# Altium schematic sheet L3X-433UD33X_Footprint&Part_PCB_AD.SchDoc
size 863 x 558 mm
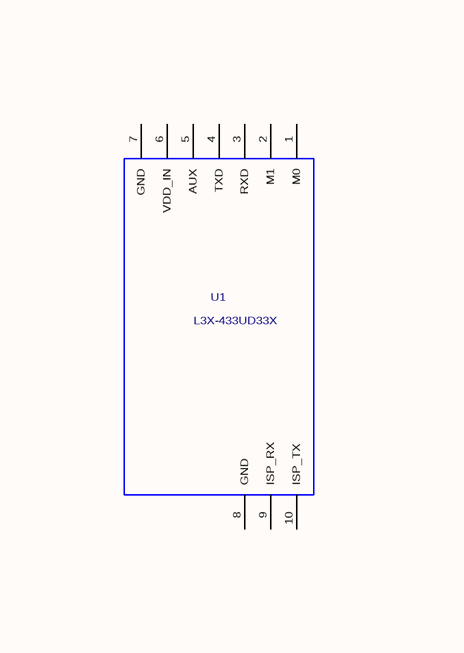
[diagram p0: L3X-433UD33X_Footprint&Part_PCB_AD.SchDoc, top column 2 of 4]

## Parts
U1  L3X-433UD33X  [L3X-433UD33X]

## Nets

Not connected (* = marked no-connect by the designer): U1 1(M0) 2(M1) 3(RXD) 4(TXD) 5(AUX) 6(VDD_IN) 7(GND) 8(GND) 9(ISP_RX) 10(ISP_TX)

## Library data of the parts
U1 = L3X-433UD33X: PCB DECAL: L3X-433UD33X